# EasyEDA Pro project ProProject_FPGA Dev Board - ICE40HX4K-TQ144 v0.03_2024-02-22 - EASYEDA PRO PROJECT.epro, schematic schematic1
Create Date: 2024-02-15; Page Name: P1; Project Name: FPGA Dev Board - ICE40HX4K-TQ144 v0.03; Schematic Name: schematic1; Update Date: 2024-02-15; Company: EasyEDA.com; Drawn: EasyEDA; Page Size: A4; Part Number: JLCPCB-002; Reviewed: EasyEDA; Version: V0.1
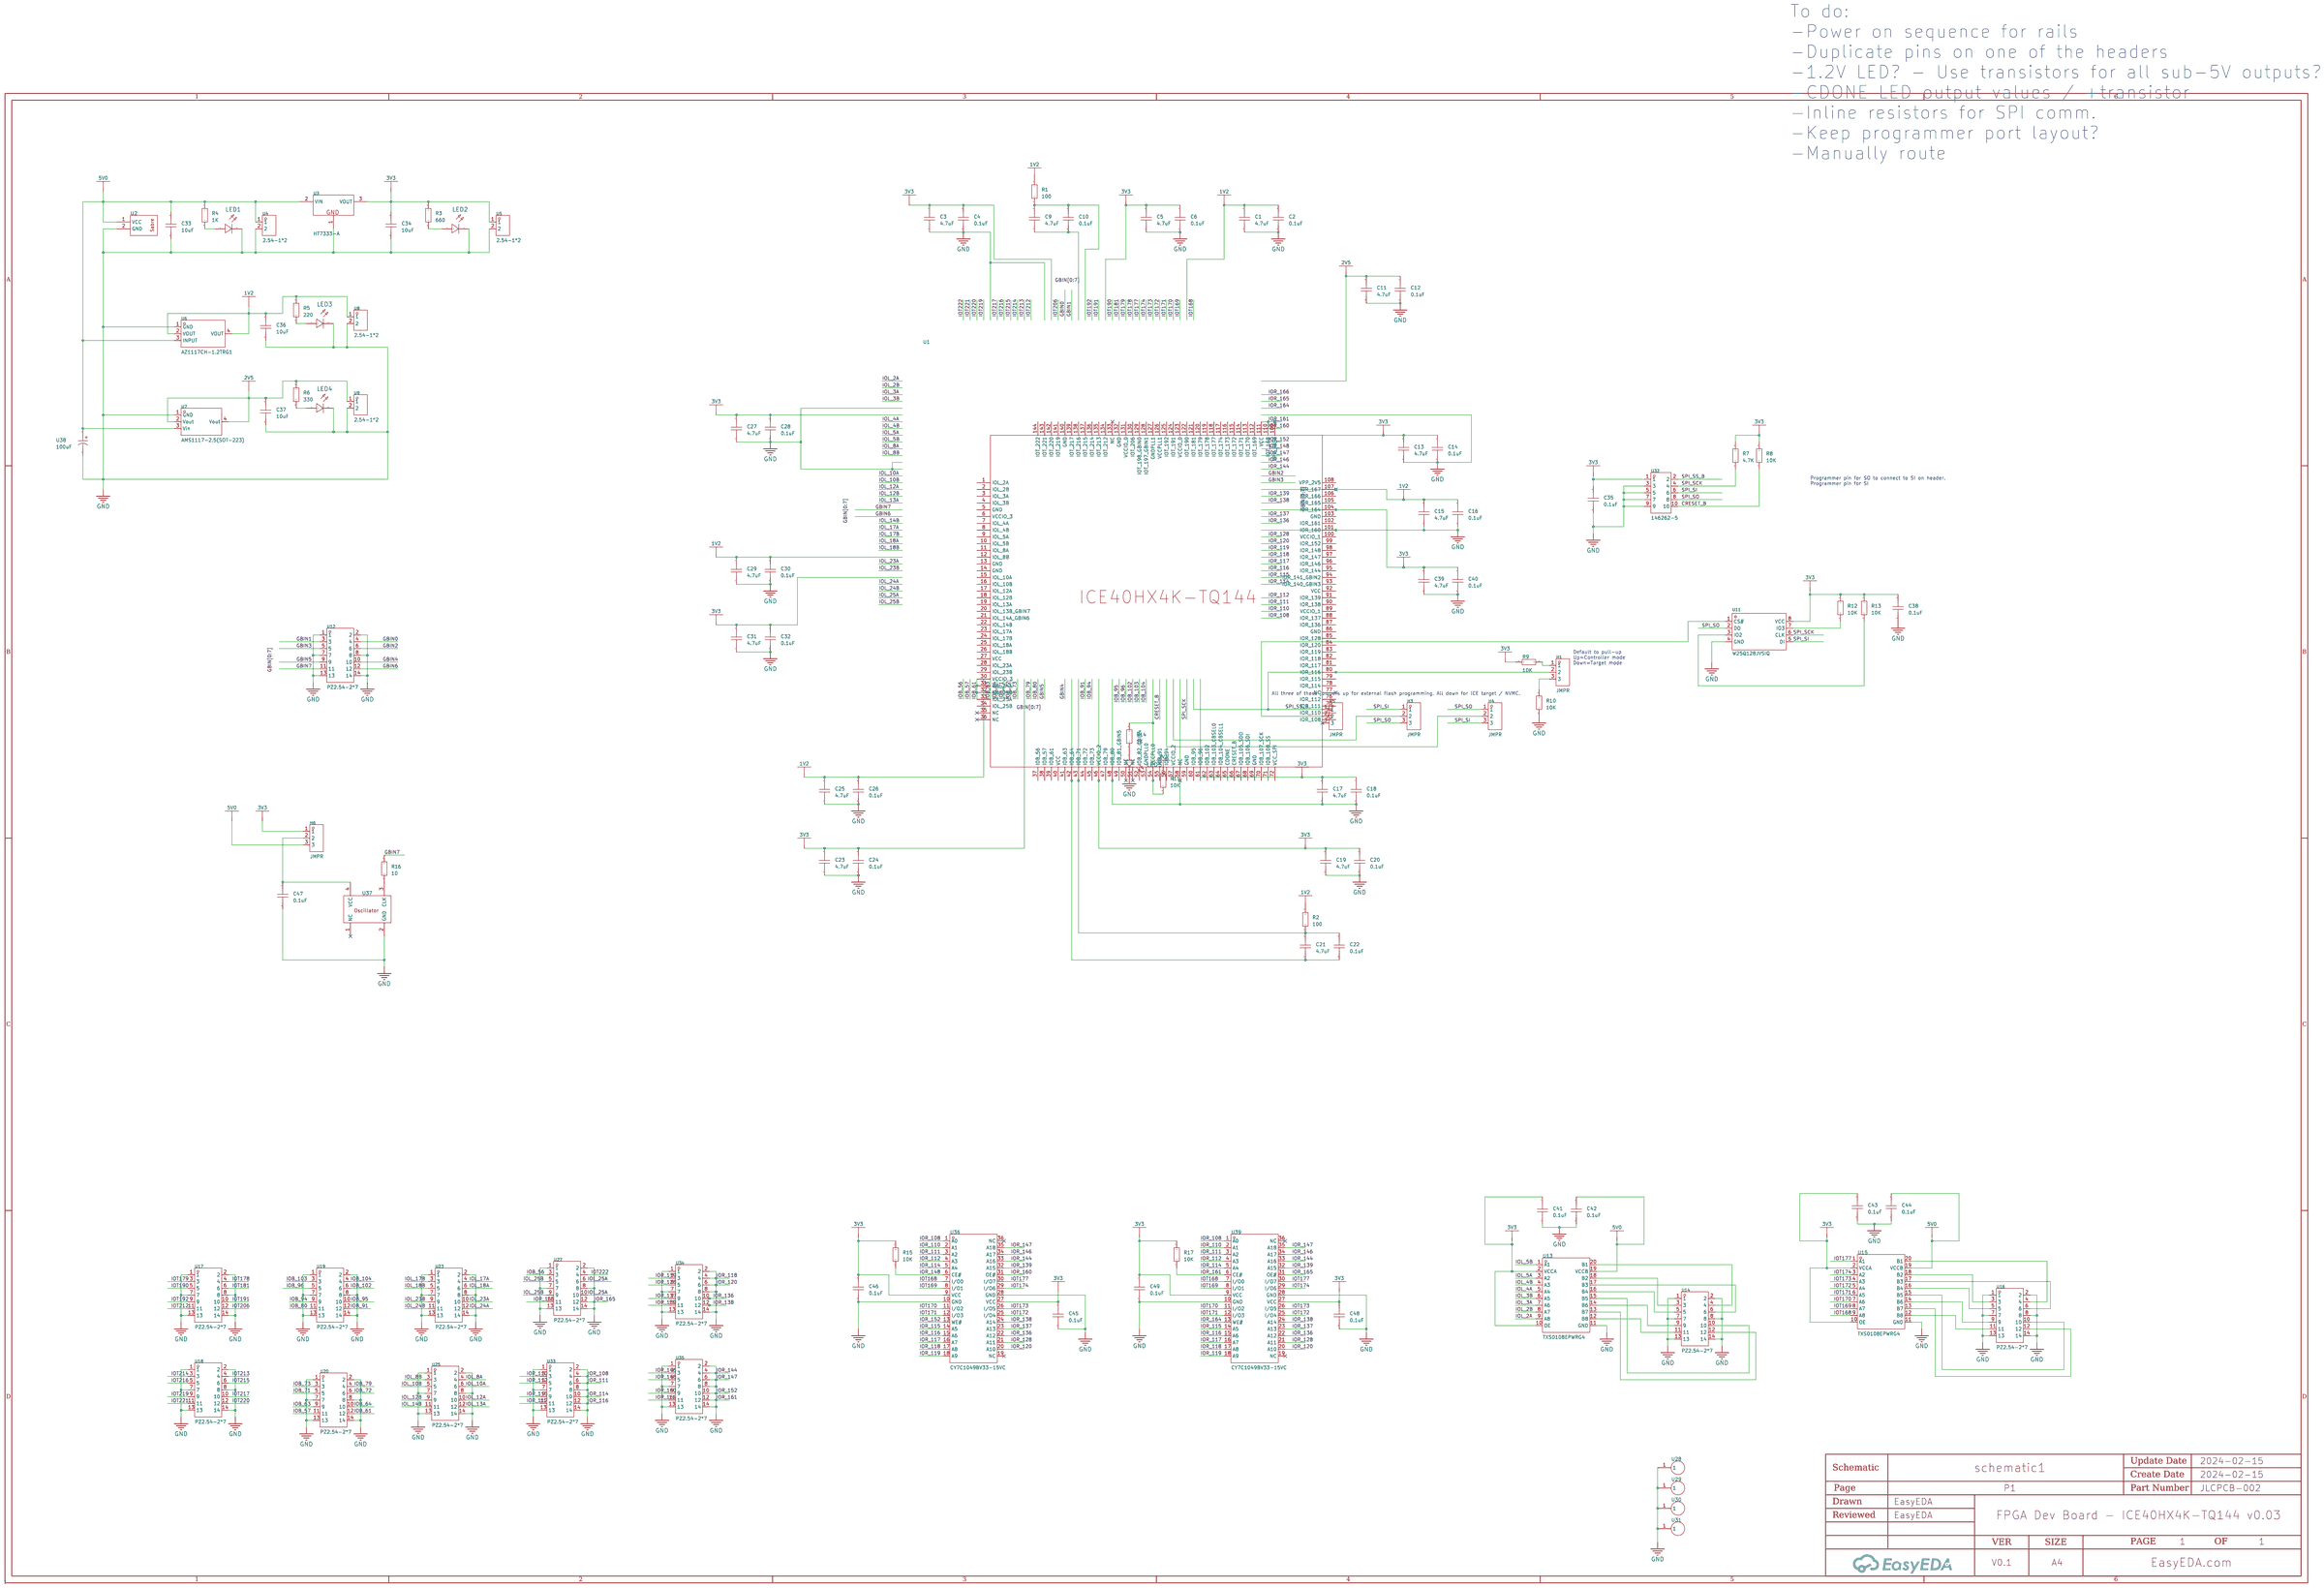
[diagram p0: schematic sheet]

## Parts
C1  4.7uF  [C0805]
C2  0.1uF  [C0603]
C3  4.7uF  [C0805]
C4  0.1uF  [C0603]
C5  4.7uF  [C0805]
C6  0.1uF  [C0603]
C9  4.7uF  [C0805]
C10  0.1uF  [C0603]
C11  4.7uF  [C0805]
C12  0.1uF  [C0603]
C13  4.7uF  [C0805]
C14  0.1uF  [C0603]
C15  4.7uF  [C0805]
C16  0.1uF  [C0603]
C17  4.7uF  [C0805]
C18  0.1uF  [C0603]
C19  4.7uF  [C0805]
C20  0.1uF  [C0603]
C21  4.7uF  [C0805]
C22  0.1uF  [C0603]
C23  4.7uF  [C0805]
C24  0.1uF  [C0603]
C25  4.7uF  [C0805]
C26  0.1uF  [C0603]
C27  4.7uF  [C0805]
C28  0.1uF  [C0603]
C29  4.7uF  [C0805]
C30  0.1uF  [C0603]
C31  4.7uF  [C0805]
C32  0.1uF  [C0603]
C33  10uF  [C1206]
C34  10uF  [C1206]
C35  0.1uF  [C0603]
C36  10uF  [C1206]
C37  10uF  [C1206]
C38  0.1uF  [C0603]
C39  4.7uF  [C0805]
C40  0.1uF  [C0603]
C41  0.1uF  [C0603]
C42  0.1uF  [C0603]
C43  0.1uF  [C0603]
C44  0.1uF  [C0603]
C45  0.1uF  [C0603]
C46  0.1uF  [C0603]
C47  0.1uF  [C0603]
C48  0.1uF  [C0603]
C49  0.1uF  [C0603]
H1  JMPR  [HDR-TH_3P-P2.54-V-M]
H3  JMPR  [HDR-TH_3P-P2.54-V-M]
H4  JMPR  [HDR-TH_3P-P2.54-V-M]
H5  JMPR  [HDR-TH_3P-P2.54-V-M]
H6  JMPR  [HDR-TH_3P-P2.54-V-M]
LED1  -  [LED0603-R-RD]
LED2  -  [LED0603-R-RD]
LED3  -  [LED0603-R-RD]
LED4  -  [LED0603-R-RD]
LED5  -  [LED0603-R-RD]
R1  100  [R0603]
R2  100  [R0603]
R3  660  [R0603]
R4  1K  [R0603]
R5  220  [R0603]
R6  330  [R0603]
R7  4.7K  [R0603]
R8  10K  [R0603]
R9  10K  [R0603]
R10  10K  [R0603]
R11  10K  [R0603]
R12  10K  [R0603]
R13  10K  [R0603]
R14  1K  [R0603]
R15  10K  [R0603]
R16  10  [R0603]
R17  10K  [R0603]
U1  -  [TQFP-144_L20.0-W20.0-P0.50-LS22.0-BL]
U2  -  [Sabre 2-pin]
U3  HT7333-A  [SOT-89-3_L4.5-W2.5-P1.50-LS4.2-BR]
U4  2.54-1*2  [HDR-TH_2P-P2.54-V-M]
U5  2.54-1*2  [HDR-TH_2P-P2.54-V-M]
U6  AZ1117CH-1.2TRG1  [SOT-223-3_L6.5-W3.4-P2.30-LS7.0-BR]
U7  AMS1117-2.5(SOT-223)  [SOT-223-4_L6.5-W3.5-P2.30-LS7.0-BR]
U8  2.54-1*2  [HDR-TH_2P-P2.54-V-M]
U9  2.54-1*2  [HDR-TH_2P-P2.54-V-M]
U11  W25Q128JVSIQ  [SOIC-8_L5.3-W5.3-P1.27-LS8.0-BL]
U12  PZ2.54-2*7  [HDR-TH_14P-P2.54-V-M-R2-C7-S2.54-1]
U13  TXS0108EPWRG4  [TSSOP-20_L6.5-W4.4-P0.65-LS6.5-BL]
U14  PZ2.54-2*7  [HDR-TH_14P-P2.54-V-M-R2-C7-S2.54-1]
U15  TXS0108EPWRG4  [TSSOP-20_L6.5-W4.4-P0.65-LS6.5-BL]
U16  PZ2.54-2*7  [HDR-TH_14P-P2.54-V-M-R2-C7-S2.54-1]
U17  PZ2.54-2*7  [HDR-TH_14P-P2.54-V-M-R2-C7-S2.54-1]
U18  PZ2.54-2*7  [HDR-TH_14P-P2.54-V-M-R2-C7-S2.54-1]
U19  PZ2.54-2*7  [HDR-TH_14P-P2.54-V-M-R2-C7-S2.54-1]
U20  PZ2.54-2*7  [HDR-TH_14P-P2.54-V-M-R2-C7-S2.54-1]
U23  PZ2.54-2*7  [HDR-TH_14P-P2.54-V-M-R2-C7-S2.54-1]
U25  PZ2.54-2*7  [HDR-TH_14P-P2.54-V-M-R2-C7-S2.54-1]
U27  PZ2.54-2*7  [HDR-TH_14P-P2.54-V-M-R2-C7-S2.54-1]
U28  -  [Standoff 3.5mm]
U29  -  [Standoff 3.5mm]
U30  -  [Standoff 3.5mm]
U31  -  [Standoff 3.5mm]
U32  146262-5  [HDR-TH_10P-P2.54-V-M-R2-C5-S2.54]
U33  PZ2.54-2*7  [HDR-TH_14P-P2.54-V-M-R2-C7-S2.54-1]
U34  PZ2.54-2*7  [HDR-TH_14P-P2.54-V-M-R2-C7-S2.54-1]
U35  PZ2.54-2*7  [HDR-TH_14P-P2.54-V-M-R2-C7-S2.54-1]
U36  CY7C1049BV33-15VC  [SOJ-36_L23.5-W10.2-P1.27-LS11.2-BL]
U37  -  [Oscillator Full TH]
U38  100uF  [CAP-TH_BD6.3-P2.50-D0.6-FD]
U39  CY7C1049BV33-15VC  [SOJ-36_L23.5-W10.2-P1.27-LS11.2-BL]

## Library data of the parts
C1 C3 C5 C9 C11 C13 C15 C17 C19 C21 C23 C25 C27 C29 C31 C39 = CAP_0805: Supplier Footprint: 0805
C2 C4 C6 C10 C12 C14 C16 C18 C20 C22 C24 C26 C28 C30 C32 C35 C38 C40-C49 = CAP_0603: Supplier Footprint: 0603
C33 C34 C36 C37 = CL31A106KBHNNNE: Capacitance: Tolerance:±10% Tolerance:±10% Voltage Rated: Temperature Coefficient:; LCSC Part Name: 10uF ±10% 50V; Supplier Part: C13585; Manufacturer: SAMSUNG(三星); Supplier Footprint: 1206; JLCPCB Part Class: Basic Part; Datasheet: https://atta.szlcsc.com/upload/public/pdf/source/20160218/1457707763339.pdf; Supplier: LCSC; Tolerance: ±10%
H1 H3-H6 = 22284033: Number of Rows:单排 Number of Pins:3 Pitch:2.54mm Pin Structure:1x3P Row Spacing:- Mounting Type:Straight Circluar Pins/Square Pins:Square Pins Current Rating (Max):- Voltage Rating (Max):- Length of Mating Pin:6.09mm Insulation Height:2.29mm Length of End; LCSC Part Name: 2.54mm 1x3P 直插 方针; Supplier Part: C587037; Manufacturer: MOLEX; Supplier Footprint: 直插,P=2.54mm; JLCPCB Part Class: Extended Part; Supplier: LCSC; Number of Rows: 单排; Number of Pins: 3; Pitch: 2.54mm; Pin Structure: 1x3P; Mounting Type: Straight; Circluar Pins/Square Pins: Square Pins; Length of Mating Pin: 6.09mm; Insulation Height: 2.29mm; Length of End Connection Pin: 3.18mm
LED1-LED5 = LED_0603-R: Supplier Footprint: 0603
R1-R17 = Res_0603: Supplier Footprint: 0603
U1 = ICE40HX4K-TQ144
U2 = Sabre 2-pin: Molex sabre header, 2-pin
U3 = HT7333-A_C5451670: Output Type:固定 Maximum Input Voltage:18V Output Voltage:3.3V Output Voltage:3.3V Output Current:250mA Output Polarity:正 Number of Outputs:1; LCSC Part Name: Vin:18V Vout:3.3V 250mA; Supplier Part: C5451670; Manufacturer: HXY MOSFET(华轩阳电子); Supplier Footprint: SOT-89; JLCPCB Part Class: Extended Part; Datasheet: https://atta.szlcsc.com/upload/public/pdf/source/20230427/0C2ED0810C4CDC8441350A12EE5F2F10.pdf; Supplier: LCSC; Output Type: 固定; Maximum Input Voltage: 18V; Output Voltage: 3.3V; Output Current: 250mA; Output Polarity: 正; Number of Outputs: 1
U4 U5 U8 U9 = 2.54-1*2: Pin Structure:1x2P Pitch:2.54mm Number of Rows:Plugin Number of Pins:2P Contact Plating:Gold; LCSC Part Name: 停产; Supplier Part: C5116481; Manufacturer: ZHOURI(洲日); Supplier Footprint: 插件,P=2.54mm; JLCPCB Part Class: Extended Part; Datasheet: https://atta.szlcsc.com/upload/public/pdf/source/20220729/DF18AADA08AA3A4F1D3B0508BB8F7248.pdf; Supplier: LCSC; Pin Structure: 1x2P; Pitch: 2.54mm; Number of Rows: Plugin; Number of Pins: 2P; Contact Plating: Gold
U6 = AZ1117CH-1.2TRG1: Output Type:固定 Output Polarity:正 Number of Outputs:1 Maximum Input Voltage:15V Output Voltage:1.2V Output Voltage:1.2V Dropout Voltage:1.3V@(800mA) Quiescent Current (Ground Current):6mA Output Current:1A Power Supply Rejection Ratio (PSRR):70dB@(120Hz) O; Supplier Part: C507895; Manufacturer: DIODES(美台); Supplier Footprint: SOT-223; JLCPCB Part Class: Extended Part; Datasheet: https://atta.szlcsc.com/upload/public/pdf/source/20200113/C481691_4CA85A195C85BD5111869557270CCBB7.pdf; Supplier: LCSC; Output Type: 固定; Output Polarity: 正; Number of Outputs: 1; Maximum Input Voltage: 15V; Output Voltage: 1.2V; Dropout Voltage: 1.3V@(800mA); Quiescent Current (Ground Current): 6mA; Output Current: 1A; Power Supply Rejection Ratio (PSRR): 70dB@(120Hz); Operating Temperature: -20℃~+125℃@(Tj)
U7 = AMS1117-2.5(SOT-223): Output Type:固定 Maximum Input Voltage:18V Output Voltage:2.5V Output Voltage:2.5V Output Current:1A Dropout Voltage:1.4V@(1A) Output Polarity:正 Number of Outputs:1; LCSC Part Name: 输入18V 输出2.5V 1A; Supplier Part: C5346134; Manufacturer: HXY MOSFET(华轩阳电子); Supplier Footprint: SOT-223; JLCPCB Part Class: Extended Part; Datasheet: https://atta.szlcsc.com/upload/public/pdf/source/20230112/E762ED9FBAA0859C5A1A23C5A68BE95D.pdf; Supplier: LCSC; Output Type: 固定; Maximum Input Voltage: 18V; Output Voltage: 2.5V; Output Current: 1A; Dropout Voltage: 1.4V@(1A); Output Polarity: 正; Number of Outputs: 1
U11 = W25Q128JVSIQ: Interface Type:- Memory Size:128Mbit Clock Frequency (fc):- Supply Voltage:- Supply Voltage:- Supply Current (Read):- Supply Current (Program):- Supply Current (Erase):- Standby supply current:- Page Programming Time (Tpp):- Block Erase Time (tBE):- Data; LCSC Part Name: W25Q128JVSIQ 编带; Supplier Part: C97521; Manufacturer: WINBOND(华邦); Supplier Footprint: SOP-8-208mil; JLCPCB Part Class: Basic Part; Datasheet: https://atta.szlcsc.com/upload/public/pdf/source/20170316/1489627409956.pdf; Supplier: LCSC; Memory Size: 128Mbit
U12 U14 U16-U20 U23 U25 U27 U33-U35 = PZ2.54-2*7: Pin Structure:2x7P Pitch:2.54mm Number of Rows:双排 Number of Pins:14P; Supplier Part: C5156678; Manufacturer: ZHOURI(洲日); Supplier Footprint: 插件,P=2.54mm; JLCPCB Part Class: Extended Part; Datasheet: https://atta.szlcsc.com/upload/public/pdf/source/20220923/B89BA186B3836E457A1392037AF3AC1C.pdf; Supplier: LCSC; Pin Structure: 2x7P; Pitch: 2.54mm; Number of Rows: 双排; Number of Pins: 14P
U13 U15 = TXS0108EPWRG4: Translator Type:Voltage Levels Channel Type:Bi-Directional Number of Circuits:1 Channels per Circuit:8 Supply Voltage (VCCA):1.4V~3.6V Supply Voltage (VCCB):1.65V~5.5V Input Signal:- Output Signal:- Output Type:Open Collector，Push-pull Data Rate:60Mbps Op; Supplier Part: C2677606; Supplier Footprint: TSSOP-20; JLCPCB Part Class: Extended Part; Datasheet: https://atta.szlcsc.com/upload/public/pdf/source/20210701/013C61FAA03EDF6D6F46F271F8BE99F6.pdf; Supplier: LCSC; Translator Type: Voltage Levels; Channel Type: Bi-Directional; Number of Circuits: 1; Channels per Circuit: 8; Supply Voltage (VCCA): 1.4V~3.6V; Supply Voltage (VCCB): 1.65V~5.5V; Output Type: Open Collector，Push-pull; Data Rate: 60Mbps; Operating Temperature: -40℃~+85℃; Features: 自动方向检测
U28-U31 = Standoff 3.5mm
U32 = 146262-5: Pitch:2.54mm Row Spacing:2.54mm Mounting Type:Straight Number of Rows:双排 Number of Pins:10P Current Rating (Max):3A Contact Material: Contact Plating:铅锡 Operating Temperature Range:-65℃~+105℃ Operating Temperature Range:-65℃~+105℃ Color:Black; LCSC Part Name: 间距:2.54mm 直插; Supplier Part: C6785361; Manufacturer: TE Connectivity(泰科电子); Supplier Footprint: 插件,P=2.54mm; Supplier: LCSC; Pitch: 2.54mm; Row Spacing: 2.54mm; Mounting Type: Straight; Number of Rows: 双排; Number of Pins: 10P; Current Rating (Max): 3A; Contact Plating: 铅锡; Operating Temperature Range: -65℃~+105℃; Color: Black
U36 U39 = CY7C1049BV33-15VC: Memory Size:4Mbit upply Voltage (Vcc):3V~3.6V upply Voltage (Vcc):3V~3.6V Operating Temperature:0℃~+70℃ Operating Temperature:0℃~+70℃; Supplier Part: C2955791; Manufacturer: CYPRESS(赛普拉斯); Supplier Footprint: BSOJ-36; JLCPCB Part Class: Extended Part; Supplier: LCSC; Memory Size: 4Mbit; upply Voltage (Vcc): 3V~3.6V; Operating Temperature: 0℃~+70℃
U37 = Oscillator Socket Full
U38 = 152EC0410: Capacitance:100uF Tolerance:±20% Tolerance:±20% Rated Voltage: Ripple Current:317mA@100kHz Equivalent Series Resistance(ESR):480mΩ@100kHz Lead Spacing:2.5mm φD: L: Lifetime @ Temp:2000hrs@105℃ Operating Temperature:-40℃~+105℃ Operating Temperature:-40℃~+1; LCSC Part Name: 100uF ±20% 50V; Supplier Part: C6718390; Manufacturer: KNSCHA(科尼盛); Supplier Footprint: 插件,D6.3xL12mm; JLCPCB Part Class: Extended Part; Datasheet: https://atta.szlcsc.com/upload/public/pdf/source/20230526/779F8EE873D34EDA1778E30D1C192FAA.pdf; Supplier: LCSC; Tolerance: ±20%; Ripple Current: 317mA@100kHz; Equivalent Series Resistance(ESR): 480mΩ@100kHz; Lead Spacing: 2.5mm; Lifetime @ Temp: 2000hrs@105℃; Operating Temperature: -40℃~+105℃

## Nets
1V2: C1.2 C2.1 C15.2 C16.1 C25.2 C26.1 C29.2 C30.1 C36.1 R1.1 R2.1 R5.1 U1.107(IOR_167) U6.2(VOUT) U6.4(VOUT) U8.1
2V5: C11.2 C12.1 C37.1 R6.1 U7.2(Vout) U7.4(Vout) U9.1
3V3: C3.2 C4.1 C5.2 C6.1 C13.2 C14.1 C17.2 C18.1 C19.2 C20.1 C23.2 C24.1 C27.2 C28.1 C31.2 C32.1 C34.1 C35.1 C38.1 C39.2 C40.1 C41.1 C43.1 C45.1 C46.1 C48.1 C49.1 H6.1 R3.2 R7.2 R8.2 R9.2 R11.2 R12.1 R13.1 R15.2 R17.2 U1.46(VCCIO_2) U1.104(IOR_164) U3.3(VOUT) U5.1 U11.8(VCC) U13.2(VCCA) U13.10(OE) U15.2(VCCA) U15.10(OE) U32.1 U36.9(VCC) U36.27(VCC) U39.9(VCC) U39.27(VCC)
5V0: C33.1 C42.1 C44.1 H6.3 R4.1 U2.1(VCC) U3.2(VIN) U4.1 U6.3(INPUT) U7.3(Vin) U13.19(VCCB) U15.19(VCCB) U38.1
GND: C1.1 C2.2 C3.1 C4.2 C5.1 C6.2 C11.1 C12.2 C13.1 C14.2 C15.1 C16.2 C17.1 C18.2 C19.1 C20.2 C23.1 C24.2 C25.1 C26.2 C27.1 C28.2 C29.1 C30.2 C31.1 C32.2 C33.2 C34.2 C35.2 C36.2 C37.2 C38.2 C39.1 C40.2 C41.2 C42.2 C43.2 C44.2 C45.2 C46.2 C47.2 C48.2 C49.2 LED1.2(C) LED2.2(C) LED3.2(C) LED4.2(C) LED5.2(C) R10.1 U1.48(IOB_80) U1.58(NC) U1.101(IOR_160) U2.2(GND) U3.1(GND) U4.2 U5.2 U6.1(GND) U7.1(GND) U8.2 U9.2 U11.4(GND) U12.1 U12.2 U12.7 U12.8 U12.13 U12.14 U13.11(GND) U14.1 U14.2 U14.7 U14.8 U14.13 U14.14 U15.11(GND) U16.1 U16.2 U16.7 U16.8 U16.13 U16.14 U17.1 U17.2 U17.7 U17.8 U17.13 U17.14 U18.1 U18.2 U18.7 U18.8 U18.13 U18.14 U19.1 U19.2 U19.7 U19.8 U19.13 U19.14 U20.1 U20.2 U20.7 U20.8 U20.13 U20.14 U23.1 U23.2 U23.7 U23.8 U23.13 U23.14 U25.1 U25.2 U25.7 U25.8 U25.13 U25.14 U27.1 U27.2 U27.7 U27.8 U27.13 U27.14 U28.1 U29.1 U30.1 U31.1 U32.3 U32.5 U32.7 U32.9 U33.1 U33.2 U33.7 U33.8 U33.13 U33.14 U34.1 U34.2 U34.7 U34.8 U34.13 U34.14 U35.1 U35.2 U35.7 U35.8 U35.13 U35.14 U36.10(GND) U36.28(GND) U37.2(GND) U38.2 U39.10(GND) U39.28(GND)
CRESET_B: R8.1 U32.10
GBIN0: U12.4
GBIN1: U12.3
GBIN2: U12.6
GBIN3: U12.5
GBIN4: U12.10
GBIN5: U12.9
GBIN6: U12.12
GBIN7: R16.2 U12.11
IOB_56: U27.3
IOB_57: U20.11
IOB_61: U1.30(VCCIO_3) U1.31(IOL_24A) U1.32(IOL_24B) U1.33(IOL_25A) U20.12
IOB_63: U20.9
IOB_64: U20.10
IOB_71: U20.5
IOB_72: U20.6
IOB_73: U20.3
IOB_79: U20.4
IOB_80: U19.11
IOB_91: U19.12
IOB_94: U19.9
IOB_95: U19.10
IOB_96: U19.5
IOB_102: U19.6
IOB_103: U19.3
IOB_104: U19.4
IOL_2A: U13.9(A8)
IOL_2B: U13.8(A7)
IOL_3A: U13.7(A6)
IOL_3B: U13.6(A5)
IOL_4A: U13.5(A4)
IOL_4B: U13.4(A3)
IOL_5A: U13.3(A2)
IOL_5B: U13.1(A1)
IOL_8A: U25.4
IOL_8B: U25.3
IOL_10A: U25.6
IOL_10B: U25.5
IOL_12A: U25.10
IOL_12B: U25.9
IOL_13A: U25.12
IOL_14B: U25.11
IOL_17A: U23.4
IOL_17B: U23.3
IOL_18A: U23.6
IOL_18B: U23.5
IOL_23A: U23.10
IOL_23B: U23.9
IOL_24A: U23.12
IOL_24B: U23.11
IOL_25A: U27.6 U27.10
IOL_25B: U27.5 U27.9
IOR_108: U33.4 U36.1(A0) U39.1(A0)
IOR_110: U33.3 U36.2(A1) U39.2(A1)
IOR_111: U33.6 U36.3(A2) U39.3(A2)
IOR_112: U33.5 U36.4(A3) U39.4(A3)
IOR_114: U33.10 U36.5(A4) U39.5(A4)
IOR_115: U33.9 U36.14(A5) U39.14(A5)
IOR_116: U33.12 U36.15(A6) U39.15(A6)
IOR_117: U33.11 U36.16(A7) U39.16(A7)
IOR_118: U34.4 U36.17(A8) U39.17(A8)
IOR_119: U34.3 U36.18(A9) U39.18(A9)
IOR_120: U34.6 U36.20(A10) U39.20(A10)
IOR_128: U34.5 U36.21(A11) U39.21(A11)
IOR_136: U34.10 U36.22(A12) U39.22(A12)
IOR_137: U34.9 U36.23(A13) U39.23(A13)
IOR_138: U34.12 U36.24(A14) U39.24(A14)
IOR_139: U34.11 U36.32(A15) U39.32(A15)
IOR_144: U35.4 U36.33(A16) U39.33(A16)
IOR_146: U35.3 U36.34(A17) U39.34(A17)
IOR_147: U35.6 U36.35(A18) U39.35(A18)
IOR_148: R15.1 U35.5 U36.6(CE#)
IOR_152: U35.10 U36.13(WE#)
IOR_160: U35.9 U36.31(OE#)
IOR_161: R17.1 U1.109(VPP_FAST) U1.110(IOT_168) U1.111(VCC) U35.12 U39.6(CE#)
IOR_164: U35.11 U39.13(WE#)
IOR_165: U27.12 U39.31(OE#)
IOR_166: U27.11
IOT168: U15.9(A8) U36.7(I/O0) U39.7(I/O0)
IOT169: U15.8(A7) U36.8(I/O1) U39.8(I/O1)
IOT170: U15.7(A6) U36.11(I/O2) U39.11(I/O2)
IOT171: U15.6(A5) U36.12(I/O3) U39.12(I/O3)
IOT172: U15.5(A4) U36.25(I/O4) U39.25(I/O4)
IOT173: U15.4(A3) U36.26(I/O5) U39.26(I/O5)
IOT174: U15.3(A2) U36.29(I/O6) U39.29(I/O6)
IOT177: U15.1(A1) U36.30(I/O7) U39.30(I/O7)
IOT178: U17.4
IOT179: U17.3
IOT181: U17.6
IOT190: U17.5
IOT191: U17.10
IOT192: U17.9
IOT206: U17.12
IOT212: U17.11
IOT213: U18.4
IOT214: U18.3
IOT215: U18.6
IOT216: U18.5
IOT217: U18.10
IOT219: U18.9
IOT220: U18.12
IOT221: U18.11
IOT222: U27.4
SPI_SCK: R7.1 U11.6(CLK) U32.4
SPI_SI: H3.1 H4.3 U11.5(DI) U32.6
SPI_SO: H3.3 H4.1 U11.2(DO) U32.8
SPI_SS_B: H1.2 H5.1 U1.80(IOR_116) U32.2
$1N3621: LED1.1(A) R4.2
$1N3623: LED2.1(A) R3.1
$1N4030: LED3.1(A) R5.2
$1N4120: LED4.1(A) R6.2
$1N5384: H1.1 R9.1
$1N5387: H1.3 R10.2
$1N5672: H5.2 U11.1(CS#)
$1N5724: R12.2 U11.7(IO3)
$1N7458: U13.20(B1) U14.4
$1N7463: U13.18(B2) U14.3
$1N7473: U13.17(B3) U14.6
$1N7478: U13.16(B4) U14.5
$1N7488: U13.15(B5) U14.10
$1N7505: U13.14(B6) U14.9
$1N7510: U13.13(B7) U14.12
$1N7517: U13.12(B8) U14.11
$1N7832: U15.20(B1) U16.4
$1N7836: U15.18(B2) U16.3
$1N7840: U15.17(B3) U16.6
$1N7844: U15.16(B4) U16.5
$1N7848: U15.15(B5) U16.10
$1N7854: U15.14(B6) U16.9
$1N7858: U15.13(B7) U16.12
$1N7864: U15.12(B8) U16.11
$1N11715: R13.2 U11.3(IO2)
$1N13582: LED5.1(A) R14.1
$1N14467: C47.1 H6.2 U37.4(VCC)
$1N14519: R16.1 U37.3(CLK)
Net-(C9-1): C9.1 C10.2
Net-(C9-2): C9.2 C10.1 R1.2
Net-(C21-1): C21.1 C22.2 U1.42(IOB_64)
Net-(C21-2): C21.2 C22.1 R2.2 U1.43(IOB_71)
Net-(R11-1): R11.1 R14.2 U1.54(VCCPLL0)

Not connected (* = marked no-connect by the designer): H3 2; H4 2; H5 3*; U1 1(IOL_2A) 2(IOL_2B) 3(IOL_3A) 4(IOL_3B) 5(GND) 6(VCCIO_3) 7(IOL_4A) 8(IOL_4B) 9(IOL_5A) 10(IOL_5B) 11(IOL_8A) 12(IOL_8B) 13(GND) 14(GND) 15(IOL_10A) 16(IOL_10B) 17(IOL_12A) 18(IOL_12B) 19(IOL_13A) 20(IOL_13B_GBIN7) 21(IOL_14A_GBIN6) 22(IOL_14B) 23(IOL_17A) 24(IOL_17B) 25(IOL_18A) 26(IOL_18B) 27(VCC) 28(IOL_23A) 29(IOL_23B) 34(IOL_25B) 35(NC)* 36(NC)* 37(IOB_56) 38(IOB_57) 39(IOB_61) 40(VCC) 41(IOB_63) 44(IOB_72) 45(IOB_73) 47(IOB_79) 49(IOB_81_GBIN5) 50(NC)* 51(NC)* 52(IOB_82_GBIN4) 53(GNDPLL0) 55(IOB_91) 56(IOB_94) 57(VCCIO_2) 59(GND) 60(IOB_95) 61(IOB_96) 62(IOB_102) 63(IOB_103_CBSEL0) 64(IOB_104_CBSEL1) 65(CDONE) 66(CRESET_B) 67(IOB_105_SDO) 68(IOB_106_SDI) 69(GND) 70(IOB_107_SCK) 71(IOB_108_SS) 72(VCC_SPI) 73(IOR_108) 74(IOR_110) 75(IOR_111) 76(IOR_112) 77(NC)* 78(IOR_114) 79(IOR_115) 81(IOR_117) 82(IOR_118) 83(IOR_119) 84(IOR_120) 85(IOR_128) 86(GND) 87(IOR_136) 88(IOR_137) 89(VCCIO_1) 90(IOR_138) 91(IOR_139) 92(VCC) 93(IOR_140_GBIN3) 94(IOR_141_GBIN2) 95(IOR_144) 96(IOR_146) 97(IOR_147) 98(IOR_148) 99(IOR_152) 100(VCCIO_1) 102(IOR_161) 103(GND) 105(IOR_165) 106(IOR_166) 108(VPP_2V5) 112(IOT_169) 113(IOT_170) 114(IOT_171) 115(IOT_172) 116(IOT_173) 117(IOT_174) 118(IOT_177) 119(IOT_178) 120(IOT_179) 121(IOT_181) 122(IOT_190) 123(VCCIO_0) 124(IOT_191) 125(IOT_192) 126(VCCPLL1) 127(GNDPLL1) 128(IOT_197_GBIN1) 129(IOT_198_GBIN0) 130(IOT_206) 131(VCCIO_0) 132(GND) 133(NC)* 134(IOT_212) 135(IOT_213) 136(IOT_214) 137(IOT_215) 138(IOT_216) 139(IOT_217) 140(GND) 141(IOT_219) 142(IOT_220) 143(IOT_221) 144(IOT_222); U36 19(NC)* 36(NC)*; U37 1(NC)*; U39 19(NC)* 36(NC)*

## Notes on the sheet
- To do:
  -Power on sequence for rails
  -Duplicate pins on one of the headers
  -1.2V LED? - Use transistors for all sub-5V outputs?
  -CDONE LED output values / +transistor
  -Inline resistors for SPI comm.
  -Keep programmer port layout?
  -Manually route
- Programmer pin for SO to connect to SI on header.
  Programmer pin for SI
- Default to pull-up
  Up=Controller mode
  Down=Target mode
- All three of these jumpers up for external flash programming. All down for ICE target / NVMC.
